# EAGLE design norns-shield (EAGLE 7.6.0)

## Sheet 1 of 2
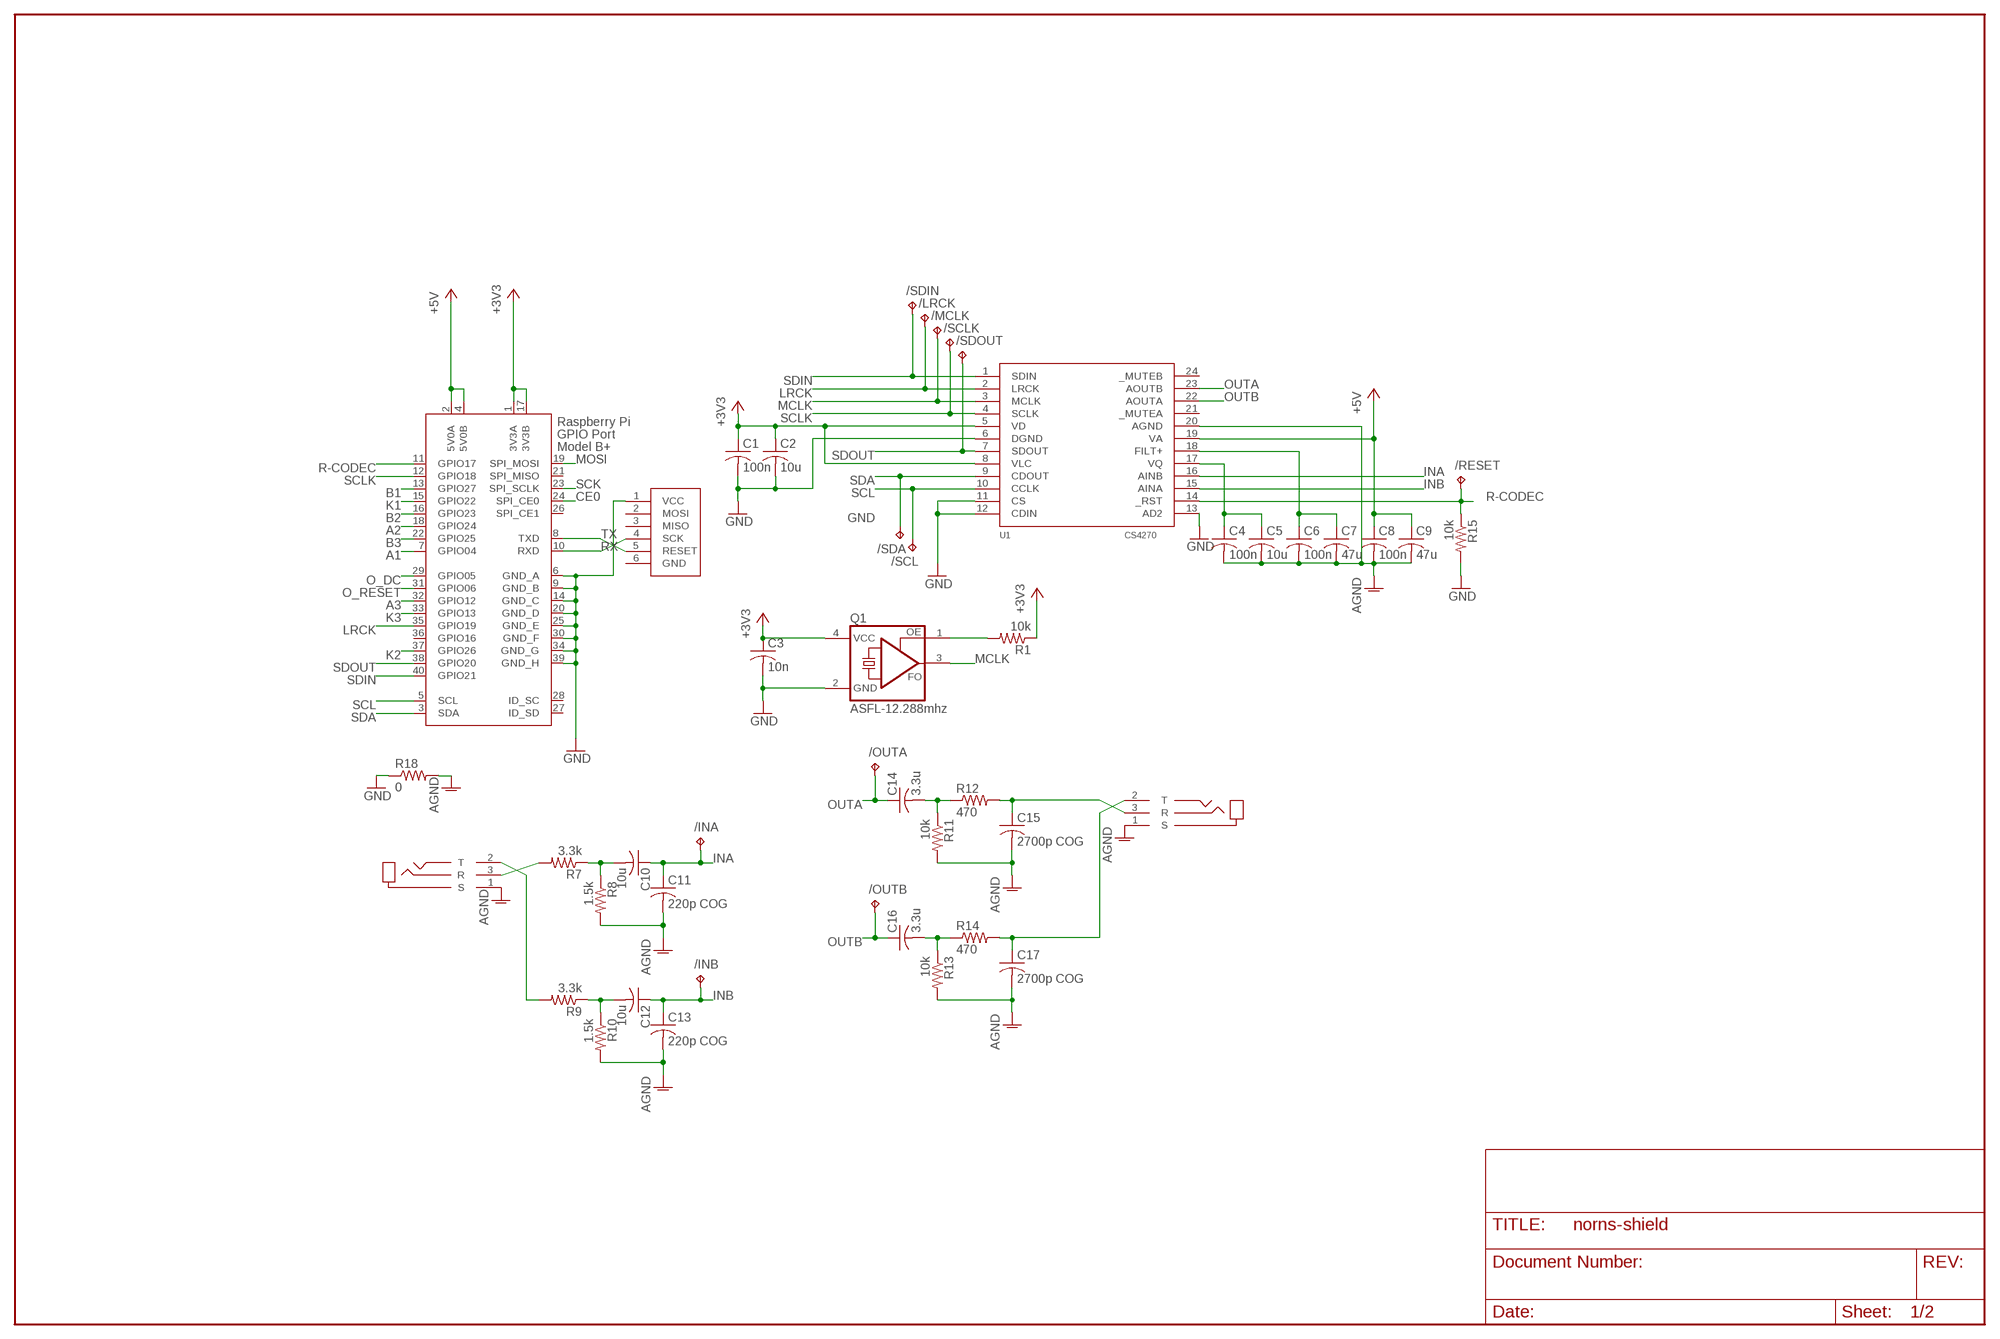
[diagram p0: schematic, sheet 1]

### Parts
/INA  TPTP12R  [TP12R]
/INB  TPTP12R  [TP12R]
/LRCK  TPTP12R  [TP12R]
/MCLK  TPTP12R  [TP12R]
/OUTA  TPTP12R  [TP12R]
/OUTB  TPTP12R  [TP12R]
/RESET  TPTP12R  [TP12R]
/SCL  TPTP12R  [TP12R]
/SCLK  TPTP12R  [TP12R]
/SDA  TPTP12R  [TP12R]
/SDIN  TPTP12R  [TP12R]
/SDOUT  TPTP12R  [TP12R]
C1  100n  C-USC0603  [C0603]
C2  10u  C-USC0805  [C0805]
C3  10n  C-USC0603  [C0603]
C4  100n  C-USC0603  [C0603]
C5  10u  C-USC0805  [C0805]
C6  100n  C-USC0603  [C0603]
C7  47u  C-USC1206  [C1206]
C8  100n  C-USC0603  [C0603]
C9  47u  C-USC1206  [C1206]
C10  10u  C-USC0805  [C0805]
C11  220p COG  C-USC0603  [C0603]
C12  10u  C-USC0805  [C0805]
C13  220p COG  C-USC0603  [C0603]
C14  3.3u  C-USC0805  [C0805]
C15  2700p COG  C-USC0603  [C0603]
C16  3.3u  C-USC0805  [C0805]
C17  2700p COG  C-USC0603  [C0603]
J1  TRS-IN  JACK-TRS  [SJ-3523-SMT]
J2  TRS-OUT  JACK-TRS  [SJ-3523-SMT]
J3  ISP-ROW  [ISP-ROW]
Q1  ASFL-12.288mhz  ASFL  [ASF]
R1  10k  R-US_R0603  [R0603]
R7  3.3k  R-US_R0603  [R0603]
R8  1.5k  R-US_R0603  [R0603]
R9  3.3k  R-US_R0603  [R0603]
R10  1.5k  R-US_R0603  [R0603]
R11  10k  R-US_R0603  [R0603]
R12  470  R-US_R0603  [R0603]
R13  10k  R-US_R0603  [R0603]
R14  470  R-US_R0603  [R0603]
R15  10k  R-US_R0603  [R0603]
R18  0  R-US_R0603  [R0603]
U1  CS4270  [TSSOP24]
X1  RASPI_BOARD_B+#_E3  [RASPI_BOARD_B+_EDGES_3DRILL]

### Nets
+3V3: C1.1 C2.1 C3.1 Q1.4(VCC) R1.1 U1.5(VD) U1.8(VLC) X1.1(3V3A) X1.17(3V3B) ; also sheet 2
+5V: C8.1 C9.1 U1.19(VA) X1.2(5V0A) X1.4(5V0B)
A1: X1.7(GPIO04) ; also sheet 2
A2: X1.18(GPIO24) ; also sheet 2
A3: X1.32(GPIO12) ; also sheet 2
AGND: C4.2 C5.2 C6.2 C7.2 C8.2 C9.2 C11.2 C13.2 C15.2 C17.2 J1.1(S) J2.1(S) R8.2 R10.2 R11.2 R13.2 R18.2 U1.20(AGND)
B1: X1.13(GPIO27) ; also sheet 2
B2: X1.16(GPIO23) ; also sheet 2
B3: X1.22(GPIO25) ; also sheet 2
CE0: X1.24(SPI_CE0) ; also sheet 2
GND: C1.2 C2.2 C3.2 J3.1(VCC) Q1.2(GND) R15.2 R18.1 U1.6(DGND) U1.11(CS) U1.12(CDIN) U1.13(AD2) X1.6(GND_A) X1.9(GND_B) X1.14(GND_C) X1.20(GND_D) X1.25(GND_E) X1.30(GND_F) X1.34(GND_G) X1.39(GND_H) ; also sheet 2
INA: /INA.TP C10.1 C11.1 U1.16(AINB)
INB: /INB.TP C12.1 C13.1 U1.15(AINA)
K1: X1.15(GPIO22) ; also sheet 2
K2: X1.37(GPIO26) ; also sheet 2
K3: X1.33(GPIO13) ; also sheet 2
LRCK: /LRCK.TP U1.2(LRCK) X1.35(GPIO19)
MCLK: /MCLK.TP Q1.3(FO) U1.3(MCLK)
MOSI: X1.19(SPI_MOSI) ; also sheet 2
N$1: Q1.1(OE) R1.2
N$4: C4.1 C5.1 U1.17(VQ)
N$5: C6.1 C7.1 U1.18(FILT+)
N$7: J1.3(R) R7.2
N$9: C10.2 R7.1 R8.1
N$10: C12.2 R9.1 R10.1
N$12: J1.2(T) R9.2
N$13: C16.2 R13.1 R14.1
N$14: C14.2 R11.1 R12.1
N$15: C15.1 J2.3(R) R12.2
N$16: C17.1 J2.2(T) R14.2
O_DC: X1.29(GPIO05) ; also sheet 2
O_RESET: X1.31(GPIO06) ; also sheet 2
OUTA: /OUTA.TP C14.1 U1.23(AOUTB)
OUTB: /OUTB.TP C16.1 U1.22(AOUTA)
R-CODEC: /RESET.TP R15.1 U1.14(_RST) X1.11(GPIO17)
RX: J3.4(SCK) X1.10(RXD)
SCK: X1.23(SPI_SCLK) ; also sheet 2
SCL: /SCL.TP U1.10(CCLK) X1.5(SCL)
SCLK: /SCLK.TP U1.4(SCLK) X1.12(GPIO18)
SDA: /SDA.TP U1.9(CDOUT) X1.3(SDA)
SDIN: /SDIN.TP U1.1(SDIN) X1.40(GPIO21)
SDOUT: /SDOUT.TP U1.7(SDOUT) X1.38(GPIO20)
TX: J3.5(RESET) X1.8(TXD)
Unconnected: J3.2(MOSI) J3.3(MISO) J3.6(GND) U1.21(_MUTEA) U1.24(_MUTEB) X1.21(SPI_MISO) X1.26(SPI_CE1) X1.27(ID_SD) X1.28(ID_SC) X1.36(GPIO16)

## Sheet 2 of 2
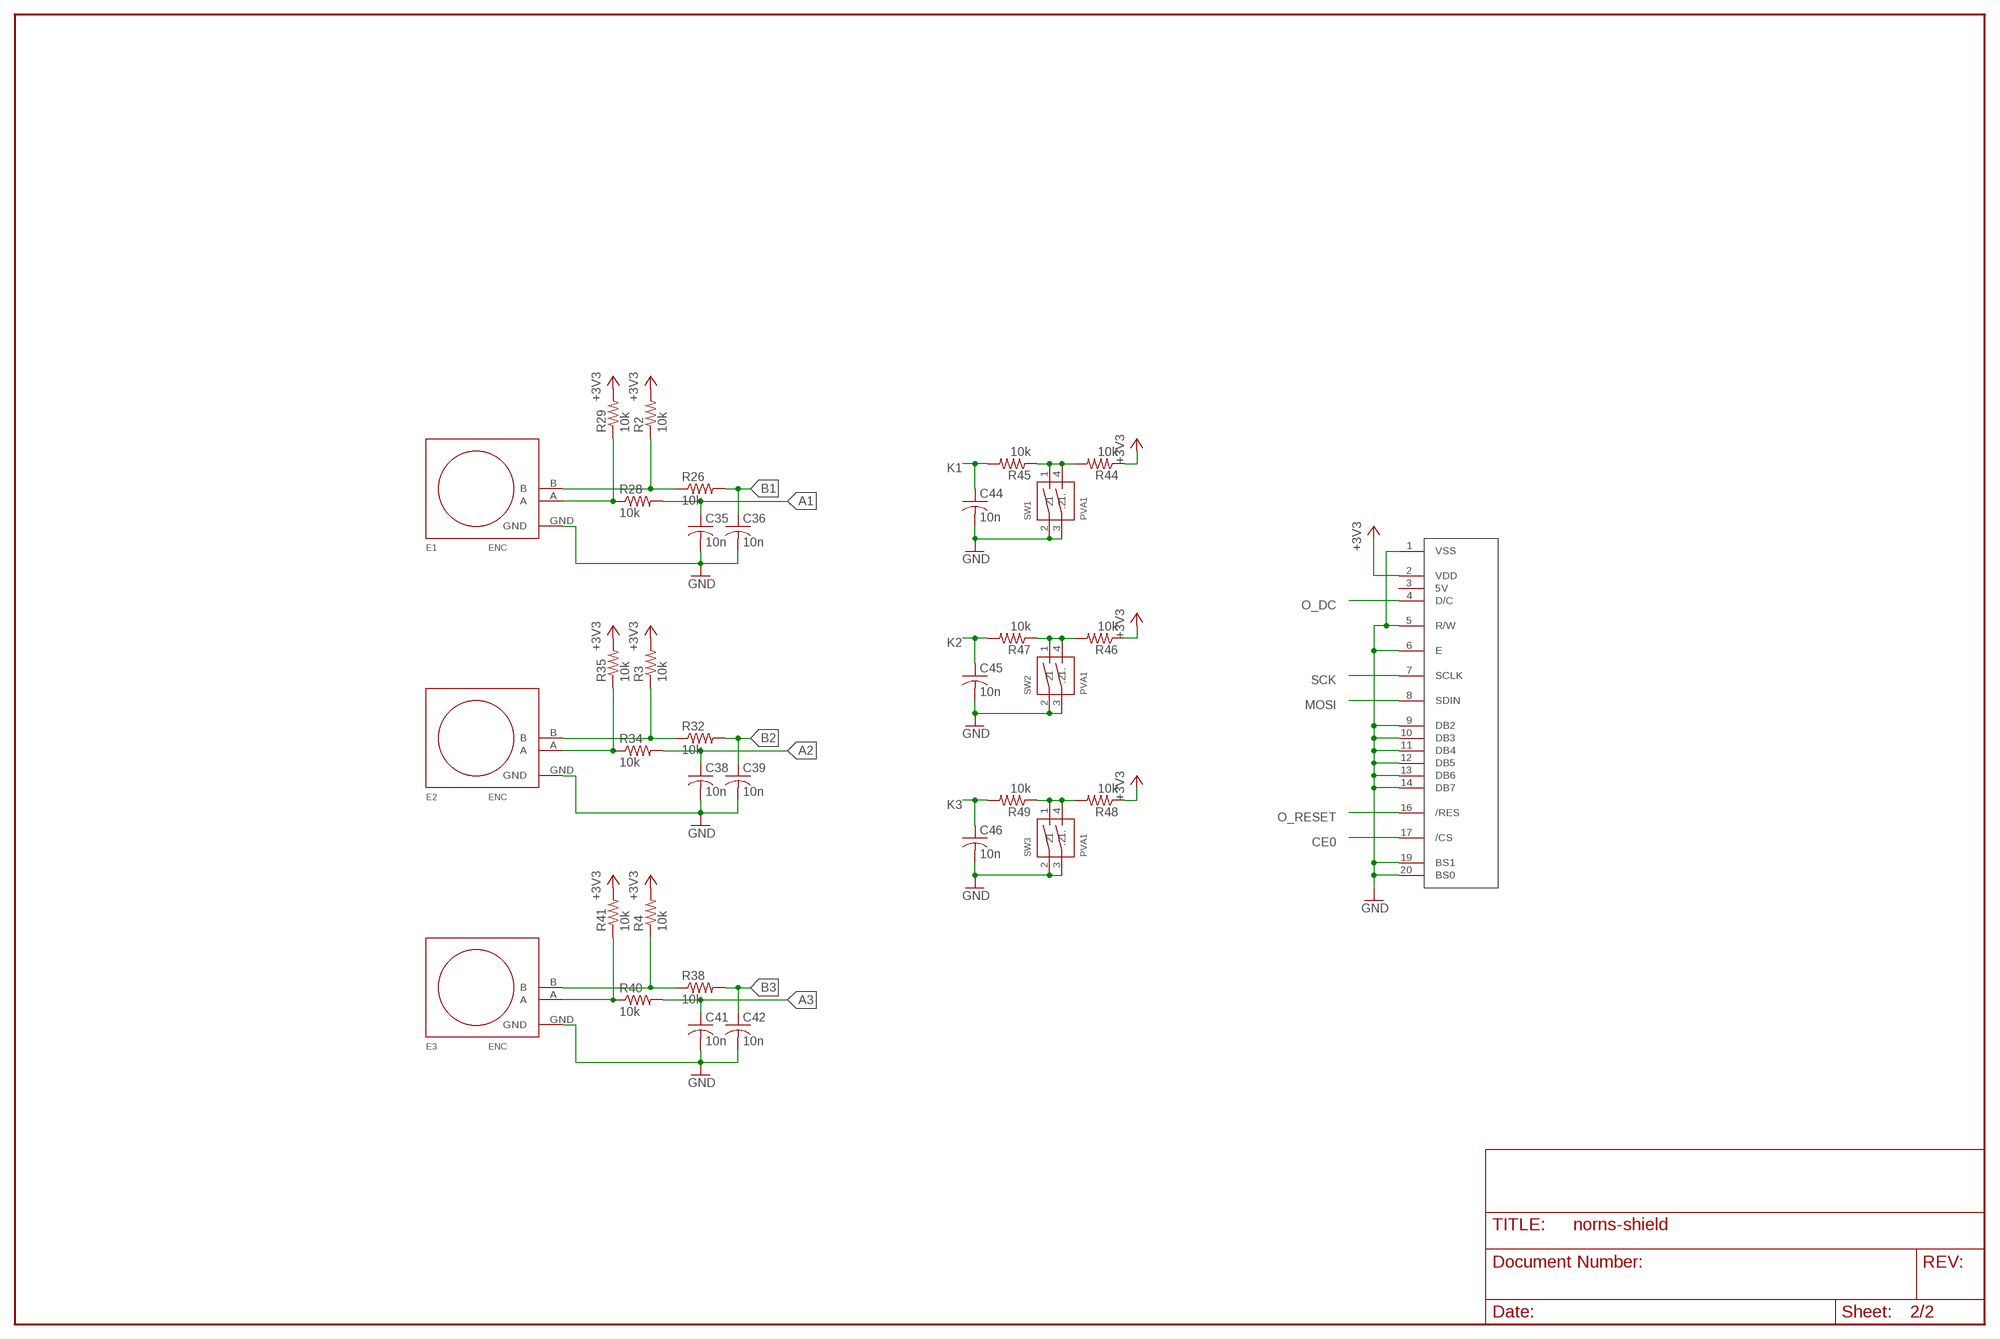
[diagram p1: schematic, sheet 2]

### Parts
C35  10n  C-USC0603  [C0603]
C36  10n  C-USC0603  [C0603]
C38  10n  C-USC0603  [C0603]
C39  10n  C-USC0603  [C0603]
C41  10n  C-USC0603  [C0603]
C42  10n  C-USC0603  [C0603]
C44  10n  C-USC0603  [C0603]
C45  10n  C-USC0603  [C0603]
C46  10n  C-USC0603  [C0603]
E1  ENC  [PEC11RN]
E2  ENC  [PEC11RN]
E3  ENC  [PEC11RN]
R2  10k  R-US_R0603  [R0603]
R3  10k  R-US_R0603  [R0603]
R4  10k  R-US_R0603  [R0603]
R26  10k  R-US_R0603  [R0603]
R28  10k  R-US_R0603  [R0603]
R29  10k  R-US_R0603  [R0603]
R32  10k  R-US_R0603  [R0603]
R34  10k  R-US_R0603  [R0603]
R35  10k  R-US_R0603  [R0603]
R38  10k  R-US_R0603  [R0603]
R40  10k  R-US_R0603  [R0603]
R41  10k  R-US_R0603  [R0603]
R44  10k  R-US_R0603  [R0603]
R45  10k  R-US_R0603  [R0603]
R46  10k  R-US_R0603  [R0603]
R47  10k  R-US_R0603  [R0603]
R48  10k  R-US_R0603  [R0603]
R49  10k  R-US_R0603  [R0603]
SW1  PVA1  [PVA1]
SW2  PVA1  [PVA1]
SW3  PVA1  [PVA1]
U$1  OLED128X64  [OLED-ALEPH]

### Nets
+3V3: R2.2 R3.2 R4.2 R29.2 R35.2 R41.2 R44.1 R46.1 R48.1 U$1.2(VDD) ; also sheet 1
A1: C35.1 R28.2 ; also sheet 1
A2: C38.1 R34.2 ; also sheet 1
A3: C41.1 R40.2 ; also sheet 1
B1: C36.1 R26.2 ; also sheet 1
B2: C39.1 R32.2 ; also sheet 1
B3: C42.1 R38.2 ; also sheet 1
CE0: U$1.17(/CS) ; also sheet 1
GND: C35.2 C36.2 C38.2 C39.2 C41.2 C42.2 C44.2 C45.2 C46.2 E1.GND E2.GND E3.GND SW1.2 SW1.3(1.) SW2.2 SW2.3(1.) SW3.2 SW3.3(1.) U$1.1(VSS) U$1.5(R/W) U$1.6(E) U$1.9(DB2) U$1.10(DB3) U$1.11(DB4) U$1.12(DB5) U$1.13(DB6) U$1.14(DB7) U$1.19(BS1) U$1.20(BS0) ; also sheet 1
K1: C44.1 R45.2 ; also sheet 1
K2: C45.1 R47.2 ; also sheet 1
K3: C46.1 R49.2 ; also sheet 1
MOSI: U$1.8(SDIN) ; also sheet 1
N$2: R44.2 R45.1 SW1.1 SW1.4(.2)
N$3: R46.2 R47.1 SW2.1 SW2.4(.2)
N$6: R48.2 R49.1 SW3.1 SW3.4(.2)
N$18: E1.A R28.1 R29.1
N$19: E1.B R2.1 R26.1
N$22: E2.B R3.1 R32.1
N$25: E2.A R34.1 R35.1
N$27: E3.B R4.1 R38.1
N$28: E3.A R40.1 R41.1
O_DC: U$1.4(D/C) ; also sheet 1
O_RESET: U$1.16(/RES) ; also sheet 1
SCK: U$1.7(SCLK) ; also sheet 1
Unconnected: U$1.3(5V)

## Library data of the parts
/INA /INB /LRCK /MCLK /OUTA /OUTB /RESET /SCL /SCLK /SDA /SDIN /SDOUT = testpad:TP: Test pad
C1-C17 C35 C36 C38 C39 C41 C42 C44-C46 = rcl:C-US: CAPACITOR, American symbol
E1-E3 = lines:ENC
J1 J2 = lines:JACK-TRS
J3 = monome-inc:ISP-ROW
Q1 = crystal:ASF*: CRYSTAL CLOCK OSCILLATORS 5.0 Vdc or 3.3 Vdc - LOW PROFILE ULTRA MINIATURE CERAMIC SURFACE MOUNT Source: http://www.abracon.com/Oscillators/asf1-L-L1.pdf; MPN: ASFLM1-50.000MHZ-C-T; OC_FARNELL: 1838931; OC_NEWARK: 99M0411
R1-R4 R7-R15 R18 R26 R28 R29 R32 R34 R35 R38 R40 R41 R44-R49 = rcl:R-US_: RESISTOR, American symbol
SW1-SW3 = monome-inc:PVA1
U1 = lines:CS4270
U$1 = monome_modular:OLED128X64
X1 = raspberrypi_bastelstube_v13:RASPI_BOARD_B+#: Raspberry Pi GPIO connector with markings for the outer dimensions of the Raspberry Pi board model B+ with different sets of drill holes or mounting pads All pins connected

## Board
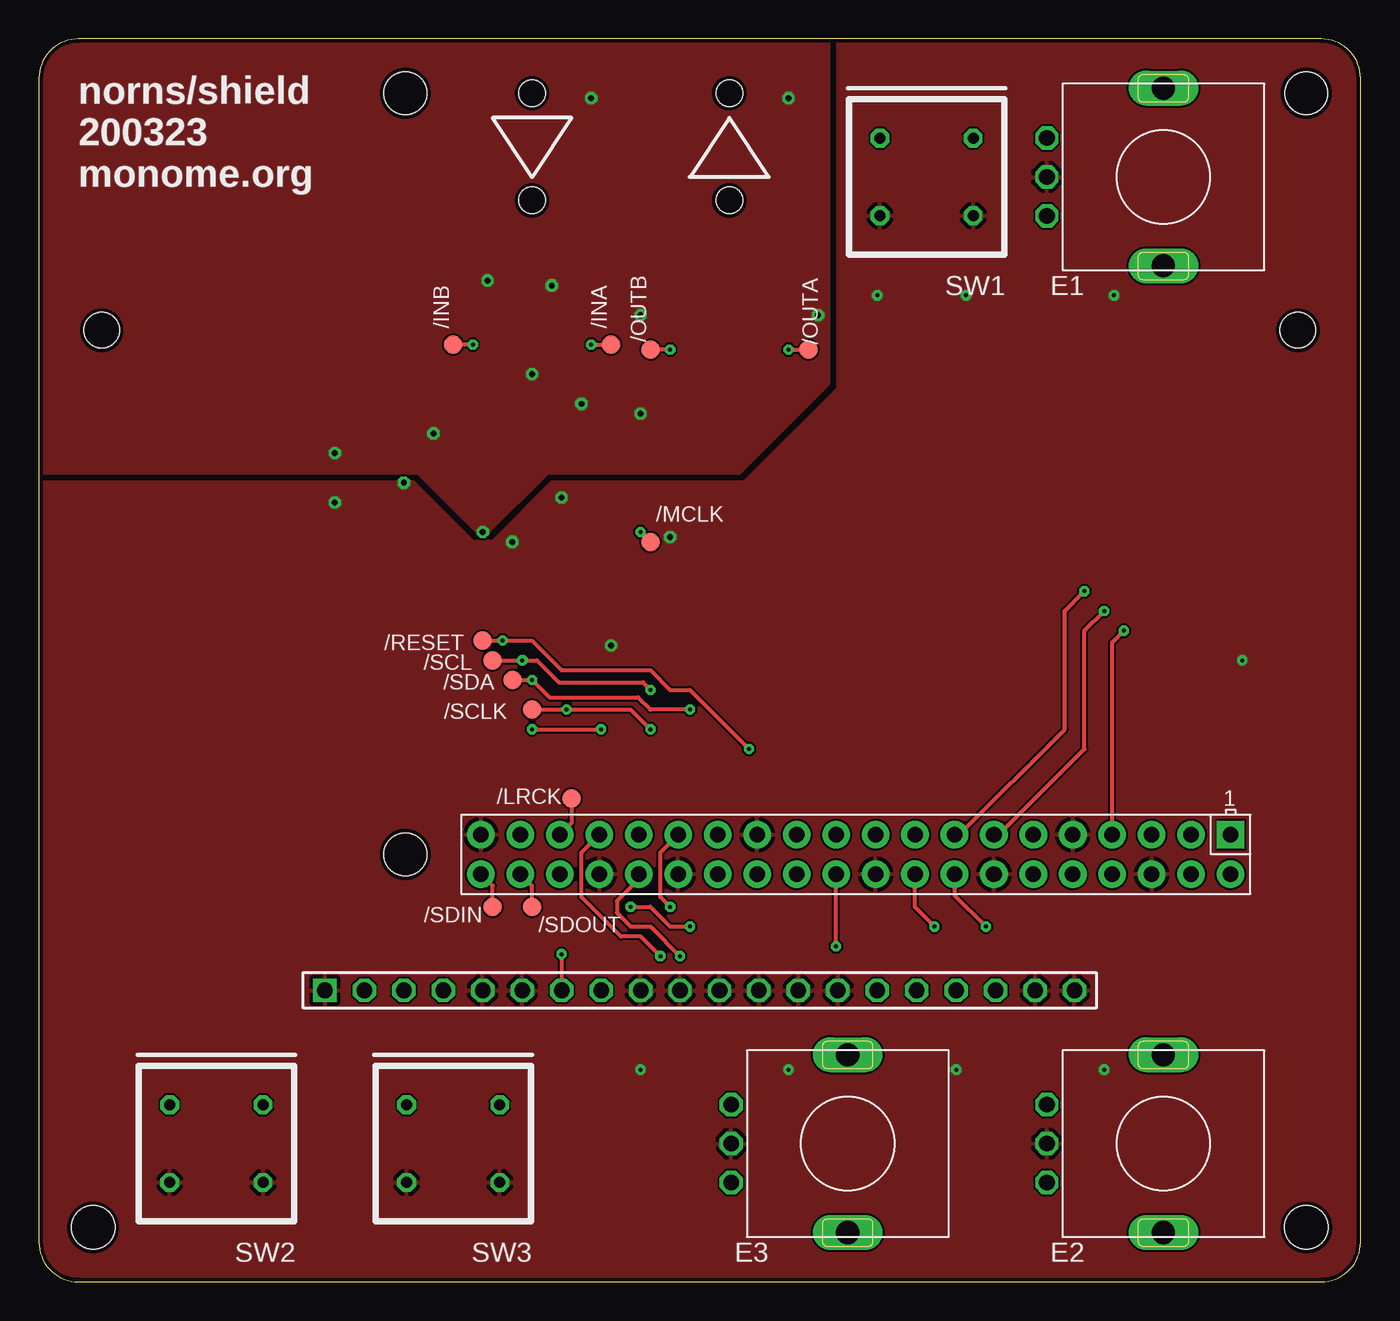
[diagram p2: board, top side]
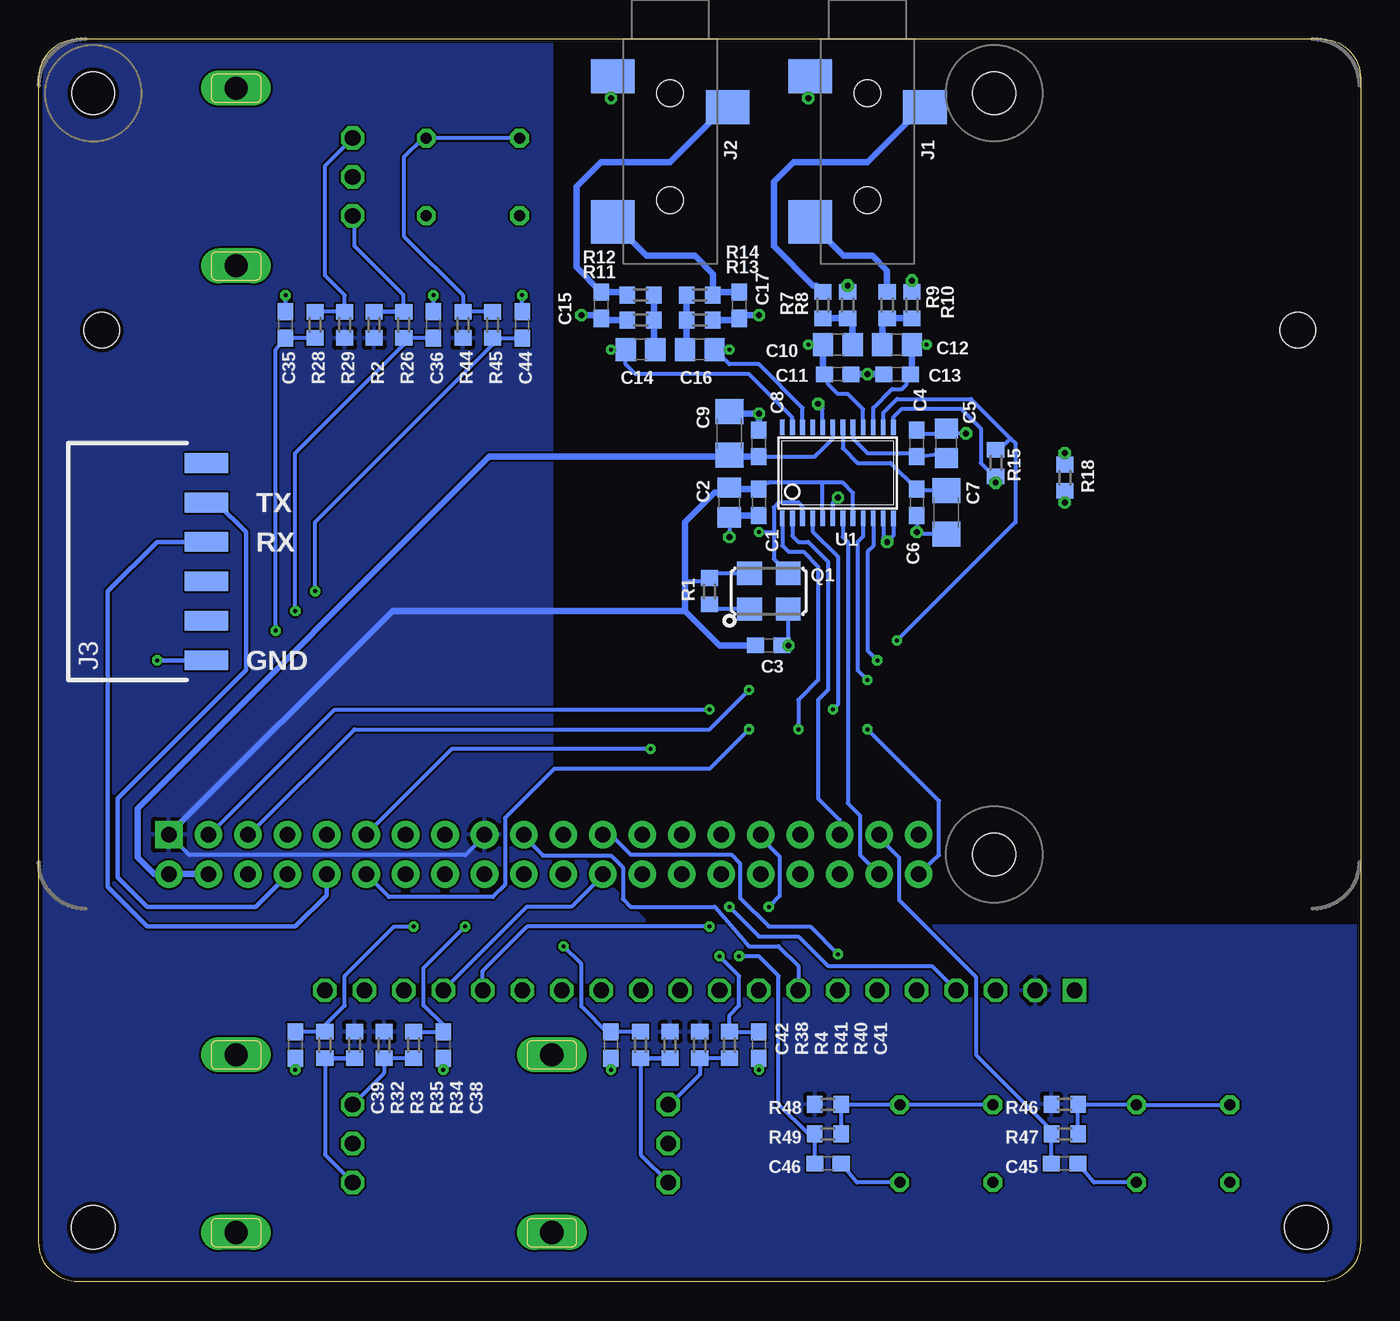
[diagram p3: board, bottom side, seen from below]

Size 85.09 x 80.01 mm. Coordinates in mm from the lower left corner, seen from the top.
Outline: 0,77.47 0,2.54 arc90 2.54,0 82.55,0 arc90 85.09,2.54 85.09,77.47 arc90 82.55,80.01 2.54,80.01 arc90 0,77.47
Copper layers (1*16): Top 0.035mm / dielectric 1.5mm / Bottom 0.035mm
Design rules "default *": minimum track width 8mil, minimum drill 10mil, track to track 5mil, track to pad 5mil, pad to pad 5mil, via to via 5mil, smd to smd 0mil, copper to edge 10mil, drill to drill 8mil, minimum pad ring 10mil, minimum via ring 8mil, stop-mask expansion 4mil, vias tented up to drill 0mil, thermal gap 10mil
Holes 2.8 mm at 81.6,3.49 3.49,3.49

### Footprints (pad centres in the part's own frame; a part is rotated, then mirrored left to right if it is on the bottom)
TP12R = smd 1.2 x 1.2: TP 0,0
C0603 = smd 1.1 x 1: 1 -0.85,0; 2 0.85,0
C0805 = smd 1.3 x 1.5: 1 -0.95,0; 2 0.95,0
C1206 = smd 1.6 x 1.8: 1 -1.4,0; 2 1.4,0
PEC11RN = drill 1 octagon: A -2.5,-7.5; B 2.5,-7.5; GND 0,-7.5 | drill 1.5 long: P$1 -5.715,0; P$2 5.715,0
SJ-3523-SMT = smd 2.2 x 2.8: 1 2.4,-3.7; 3 4.4,3.7 | smd 2.8 x 2.8: 2 11.8,-3.7 | hole 1.7: 3.5,0; 3.5,0; 10.4,0
ISP-ROW = smd 1.27 x 2.794: 1 -6.35,0; 2 -3.81,0; 3 -1.27,0; 4 1.27,0; 5 3.81,0; 6 6.35,0
ASF = smd 1.6 x 1.5: 1 -1.25,-1.15; 2 1.25,-1.15; 3 1.25,1.15; 4 -1.25,1.15
R0603 = smd 1 x 1.1: 1 -0.85,0; 2 0.85,0
PVA1 = drill 0.7 octagon: 1 -3,-2.5; 2 -3,2.5; 3 3,2.5; 4 3,-2.5
TSSOP24 = smd 0.305 x 0.991: 1 -3.575,-2.918; 2 -2.925,-2.918; 3 -2.275,-2.918; 4 -1.625,-2.918; 5 -0.975,-2.918; 6 -0.325,-2.918; 7 0.325,-2.918; 8 0.975,-2.918; 9 1.625,-2.918; 10 2.275,-2.918; 11 2.925,-2.918; 12 3.575,-2.918; 13 3.575,2.918; 14 2.925,2.918; 15 2.275,2.918; 16 1.625,2.918; 17 0.975,2.918; 18 0.325,2.918; 19 -0.325,2.918; 20 -0.975,2.918; 21 -1.625,2.918; 22 -2.275,2.918; 23 -2.925,2.918; 24 -3.575,2.918
OLED-ALEPH = drill 1 pad 1.5 square: 1 24.13,21.25 | drill 1 pad 1.5 octagon: 2 21.59,21.25; 3 19.05,21.25; 4 16.51,21.25; 5 13.97,21.25; 6 11.43,21.25; 7 8.89,21.25; 8 6.35,21.25; 9 3.81,21.25; 10 1.27,21.25; 11 -1.27,21.25; 12 -3.81,21.25; 13 -6.35,21.25; 14 -8.89,21.25; 15 -11.43,21.25; 16 -13.97,21.25; 17 -16.51,21.25; 18 -19.05,21.25; 19 -21.59,21.25; 20 -24.13,21.25 | hole 2.286: 38.5,-21.25; -38.5,-21.25
RASPI_BOARD_B+_EDGES_3DRILL = drill 1 pad 1.778 square: 1 8.37,51.23 | drill 1 pad 1.778: 2 8.37,53.77; 3 10.91,51.23; 4 10.91,53.77; 5 13.45,51.23; 6 13.45,53.77; 7 15.99,51.23; 8 15.99,53.77; 9 18.53,51.23; 10 18.53,53.77; 11 21.07,51.23; 12 21.07,53.77; 13 23.61,51.23; 14 23.61,53.77; 15 26.15,51.23; 16 26.15,53.77; 17 28.69,51.23; 18 28.69,53.77; 19 31.23,51.23; 20 31.23,53.77; 21 33.77,51.23; 22 33.77,53.77; 23 36.31,51.23; 24 36.31,53.77; 25 38.85,51.23; 26 38.85,53.77; 27 41.39,51.23; 28 41.39,53.77; 29 43.93,51.23; 30 43.93,53.77; 31 46.47,51.23; 32 46.47,53.77; 33 49.01,51.23; 34 49.01,53.77; 35 51.55,51.23; 36 51.55,53.77; 37 54.09,51.23; 38 54.09,53.77; 39 56.63,51.23; 40 56.63,53.77 | hole 2.75: 3.5,3.5; 61.5,3.5; 61.5,52.5

### Placement (x,y rotation side)
/INA  36.83,60.33 90 top
/INB  26.67,60.33 90 top
/LRCK  34.29,31.11 180 top
/MCLK  39.37,47.62 180 top
/OUTA  49.53,60.01 90 top
/OUTB  39.37,60.01 90 top
/RESET  28.57,41.27 0 top
/SCL  29.21,40 270 top
/SCLK  31.75,36.83 270 top
/SDA  30.48,38.73 270 top
/SDIN  29.21,24.13 180 top
/SDOUT  31.75,24.13 180 top
C1  38.73,50.16 270 bottom
C2  40.64,50.16 270 bottom
C3  38.1,40.96 0 bottom
C4  28.57,53.97 90 bottom
C5  26.67,53.97 90 bottom
C6  28.57,50.16 270 bottom
C7  26.67,49.53 270 bottom
C8  38.73,53.97 90 bottom
C9  40.64,54.61 90 bottom
C10  33.66,60.33 0 bottom
C11  33.66,58.42 0 bottom
C12  29.84,60.33 180 bottom
C13  29.84,58.42 180 bottom
C14  46.35,60.01 0 bottom
C15  48.9,62.86 270 bottom
C16  42.55,60.01 180 bottom
C17  40.01,62.86 270 bottom
C35  69.22,61.59 90 bottom
C36  59.69,61.59 90 bottom
C38  59.05,15.24 270 bottom
C39  68.58,15.24 270 bottom
C41  38.73,15.24 270 bottom
C42  48.26,15.24 270 bottom
C44  53.98,61.59 90 bottom
C45  19.05,7.62 0 bottom
C46  34.29,7.62 0 bottom
E1  72.39,71.12 270 top
E2  72.39,8.89 270 top
E3  52.07,8.89 270 top
J1  31.75,80.01 270 bottom
J2  44.45,80.01 270 bottom
J3  74.3,46.36 90 bottom
Q1  38.1,44.45 0 bottom
R1  41.91,44.45 270 bottom
R2  63.5,61.59 270 bottom
R3  64.77,15.24 90 bottom
R4  44.45,15.24 90 bottom
R7  34.61,62.86 90 bottom
R8  33.02,62.86 90 bottom
R9  30.48,62.86 90 bottom
R10  28.89,62.86 90 bottom
R11  46.35,61.91 180 bottom
R12  46.35,63.5 180 bottom
R13  42.55,61.91 0 bottom
R14  42.55,63.5 0 bottom
R15  23.5,52.7 270 bottom
R18  19.05,51.75 90 bottom
R26  61.59,61.59 270 bottom
R28  67.31,61.59 270 bottom
R29  65.41,61.59 270 bottom
R32  66.67,15.24 90 bottom
R34  60.96,15.24 90 bottom
R35  62.87,15.24 90 bottom
R38  46.35,15.24 90 bottom
R40  40.64,15.24 90 bottom
R41  42.55,15.24 90 bottom
R44  57.78,61.59 90 bottom
R45  55.88,61.59 270 bottom
R46  19.05,11.43 0 bottom
R47  19.05,9.52 180 bottom
R48  34.29,11.43 0 bottom
R49  34.29,9.52 180 bottom
SW1  57.15,71.12 180 top
SW2  11.43,8.89 180 top
SW3  26.67,8.89 180 top
U1  33.66,52.07 0 bottom
U$1  42.55,40 180 top
X1  85.09,80.01 180 top

### Tracks (layer width: path | path; a pad name or v marks a point on that pad's centre or on a via)
+3V3
  Bottom 0.254: 34.63,51.44 38.12,51.44 C1.1 | U1.5 34.63,51.44 | U1.8 32.68,50.78 33.34,51.44 34.63,51.44 | 40.54,51.02 C2.1 | 40.34,50.81 C2.1 | Q1.4 41.41,45.6 R1.1 41.91,45.08 43.5,45.08 | 40.95,50.8 C2.1 | X1.1 75.4,27.46 57.63,27.46 56.4,28.69 X1.17
  Bottom 0.406: C1.1 40.42,51.02 40.64,50.8 40.34,50.81 | C3.1 41.27,40.96 43.5,43.18 | 43.5,43.18 43.5,45.08 43.5,48.89 41.59,50.8 40.95,50.8 | 43.5,43.18 62.32,43.18 X1.1
  pour Bottom: 0,22.86 45.72,22.86 52.07,29.21 52.07,80.01 85.09,80.01 85.09,0 0,0
+5V
  Bottom 0.254: 40.64,53.12 C9.1 40.52,53.33 | C8.1 35.14,53.12 34.92,53.34 34.94,53.33 33.98,54.28 U1.19
  Bottom 0.406: C8.1 40.42,53.12 40.64,53.34 40.52,53.33 | 40.64,53.12 56.09,53.12 78.74,30.48 78.74,27.3 77.67,26.24 X1.2 X1.4
A1  (via drill 0.25)
  Top 0.254: X1.7 69.1,41.16 v69.85,41.91
  Bottom 0.254: R28.2 C35.1 69.85,59.99 v69.85,41.91
A2  (via drill 0.25)
  Top 0.254: v57.66,22.86 56.39,24.13 56.39,26.23 X1.18
  Bottom 0.254: R34.2 C38.1 59.04,16.52 60.33,17.78 60.33,20.19 v57.66,22.86
A3  (via drill 0.25)
  Top 0.254: X1.32 38.62,25.92 37.21,24.51 37.21,23.75 38.1,22.86 39.37,22.86 v41.27,20.95
  Bottom 0.254: C41.1 R40.2 40.64,17.14 40.01,17.78 40.01,19.68 v41.27,20.95
AGND  (via drill 0.38)
  Bottom 0.254: U1.20 34.63,56.22 v34.92,56.52 | C4.2 28.36,54.61 26.98,54.61 C5.2 26.36,54.61 v25.4,54.61 | C6.2 v28.57,48.26 28.45,48.13 C7.2 | 40.64,55.88 C9.2
  Bottom 0.406: C8.2 v38.73,55.88 40.64,55.88 | R8.2 v33.02,64.14 | R10.2 v28.89,64.45 | J1.1 35.45,77.58 35.56,77.47 v35.56,76.2 | J2.1 48.15,77.58 48.26,77.47 v48.26,76.2 | C11.2 v31.75,58.42 C13.2 | R18.2 v19.05,53.34 | R13.2 40.11,61.91 C17.2 39.79,62.23 v38.73,62.23 | R11.2 48.79,61.91 C15.2 49.11,62.23 v50.16,62.23
  pour Top: 50.8,80.01 50.8,57.78 45.09,52.07 32.7,52.07 28.89,48.26 28.26,48.26 24.45,52.07 0,52.07 0,80.01
B1  (via drill 0.25)
  Top 0.254: X1.13 61.8,28.78 67.31,34.29 67.31,41.91 v68.58,43.18
  Bottom 0.254: C36.1 R26.2 61.59,60.33 68.58,53.34 v68.58,43.18
B2  (via drill 0.25)
  Top 0.254: v60.96,22.86 58.94,24.88 X1.16
  Bottom 0.254: C39.1 R32.2 66.66,16.52 65.41,17.78 65.41,19.68 62.23,22.86 v60.96,22.86
B3  (via drill 0.25)
  Top 0.254: v51.31,21.59 51.31,26.23 X1.22
  Bottom 0.254: R38.2 C42.1 48.34,15.89 50.16,17.72 50.16,20.45 v51.31,21.59
CE0
  Bottom 0.254: X1.24 48.78,26.15 50.8,24.13 53.68,24.13 U$1.17
GND  (via drill 0.25, 0.38)
  Bottom 0.254: U1.6 33.98,50.16 v33.66,50.48 | U1.12 30.08,48.02 v30.48,47.62 30.73,47.88 U1.11 | U1.13 30.08,55.64 29.53,56.2 25.72,56.2 24.45,54.93 24.45,52.7 23.8,52.05 R15.2 v23.5,51.44 | C2.2 v40.64,47.94 | C3.2 v36.83,40.96 36.83,43.28 Q1.2 | C36.2 v59.69,63.5 | C35.2 v69.22,63.5 | C41.2 v38.73,13.65 | C42.2 v48.26,13.65 | C38.2 v59.05,13.65 | C39.2 v68.58,13.65 | C45.2 17.17,6.39 SW2.2 | C46.2 32.41,6.39 SW3.2 | C44.2 53.96,62.25 v53.98,63.5
  Bottom 0.305: J3.1 v77.47,40
  Bottom 0.406: R18.1 v19.05,50.16 | C1.2 40.54,49.31 C2.2
  pour Top: 85.09,0 85.09,80.01 51.44,80.01 51.44,57.47 45.4,51.44 33.02,51.44 29.21,47.62 27.94,47.62 24.13,51.44 0,51.44 0,0
INA  (via drill 0.25)
  Top 0.254: v35.56,60.33 /INA.TP
  Bottom 0.254: U1.16 32.03,56.16 33.02,57.15 33.66,57.15 34.29,57.78 34.29,58.41 C11.1 | C10.1 v35.56,60.33
  Bottom 0.406: C10.1 34.6,58.52 C11.1
INB  (via drill 0.25)
  Top 0.254: v27.94,60.33 /INB.TP
  Bottom 0.254: U1.15 31.38,56.25 30.16,57.47 29.53,57.47 29.21,57.78 29.21,58.41 C13.1 | C12.1 v27.94,60.33
  Bottom 0.406: C12.1 28.89,58.52 C13.1
K1  (via drill 0.25)
  Top 0.254: X1.15 59.26,28.78 66.04,35.56 66.04,43.18 v67.31,44.45
  Bottom 0.254: C44.1 R45.2 55.88,60.33 67.31,48.89 v67.31,44.45
K2
  Bottom 0.254: C45.1 R47.2 20,9.84 24.77,14.6 24.77,19.62 29.72,24.57 29.72,27.3 31,28.59 X1.37
K3  (via drill 0.25)
  Top 0.254: v40.01,20.95 38.73,22.22 37.47,22.22 34.92,24.77 34.92,27.62 X1.33
  Bottom 0.254: C46.1 R49.2 35.56,9.52 37.47,11.43 37.47,19.68 38.73,20.95 v40.01,20.95
LRCK
  Top 0.254: /LRCK.TP 34.29,29.53 X1.35
  Bottom 0.254: U1.2 36.58,48.01 36.2,47.62 35.56,47.62 34.29,46.36 34.29,38.1 34.92,37.47 34.92,31.11 33.54,29.73 X1.35
MCLK  (via drill 0.25)
  Top 0.254: /MCLK.TP v38.73,48.26
  Bottom 0.254: U1.3 35.93,49.9 36.2,50.16 37.47,50.16 37.78,49.85 37.78,48.26 | 37.78,48.26 37.78,46.53 Q1.3 | v38.73,48.26 37.78,48.26
MOSI
  Bottom 0.254: X1.19 53.86,28.65 52.64,27.43 48.26,27.43 47.5,26.67 47.5,24.64 46.99,24.13 41.57,24.13 39.37,21.59 37.47,21.59 36.2,20.32 U$1.8
N$1
  Bottom 0.254: Q1.1 41.41,43.3 R1.2
N$2
  Bottom 0.254: SW1.4 SW1.1 60.37,73.62 61.59,72.39 61.59,67.31 57.78,63.5 R44.2 R45.1
N$3
  Bottom 0.254: R47.1 R46.2 14.47,11.43 SW2.1 SW2.4
N$4
  Bottom 0.254: U1.17 32.68,54.27 31.75,53.34 28.79,53.34 C4.1 26.97,53.33 C5.1
N$5
  Bottom 0.254: U1.18 33.33,53.65 32.38,52.7 30.27,52.7 C6.1 28.49,50.93 C7.1
N$6
  Bottom 0.254: R49.1 R48.2 33.6,11.39 SW3.1 SW3.4
N$7
  Bottom 0.406: J1.3 28.21,75.61 31.75,72.07 36.51,72.07 37.78,70.8 37.78,66.67 35.24,64.14 35.03,64.14 R7.2
N$9
  Bottom 0.406: R7.1 R8.1 32.7,61.7 C10.2
N$10
  Bottom 0.406: R10.1 R9.1 30.8,61.7 C12.2
N$12
  Bottom 0.406: R9.2 30.48,65.09 31.43,66.04 33.28,66.04 J1.2
N$13
  Bottom 0.406: R14.1 R13.1 43.4,60.11 C16.2 43.83,60.34
N$14
  Bottom 0.406: R12.1 R11.1 45.51,60.11 C14.2 45.07,60.34
N$15
  Bottom 0.406: R12.2 47.42,63.72 C15.1 50.48,65.3 50.48,70.48 48.9,72.07 44.45,72.07 40.91,75.61 J2.3
N$16
  Bottom 0.406: C17.1 41.48,63.72 R14.2 41.7,64.87 42.86,66.04 45.98,66.04 J2.2
N$18
  Bottom 0.254: R28.1 R29.1 65.41,63.5 66.67,64.77 66.67,71.83 E1.A
N$19
  Bottom 0.254: R26.1 61.61,63.52 64.77,66.67 64.77,68.5 E1.B
  Bottom 0.305: R26.1 R2.1
N$22
  Bottom 0.254: R32.1 66.67,8.17 E2.B
  Bottom 0.305: R3.1 R32.1
N$25
  Bottom 0.254: R34.1 R35.1 62.87,13.41 E2.A
N$27
  Bottom 0.254: R38.1 46.35,8.17 E3.B
  Bottom 0.305: R4.1 R38.1
N$28
  Bottom 0.254: R40.1 R41.1 42.55,13.33 44.45,11.43 44.45,11.51 E3.A
O_DC  (via drill 0.25)
  Top 0.254: v40.64,24.13 40.01,24.77 40.01,27.62 X1.29
  Bottom 0.254: v40.64,24.13 38.73,22.22 36.2,22.22 34.29,20.32 27.6,20.32 U$1.4
O_RESET  (via drill 0.25)
  Top 0.254: v38.1,24.13 39.37,24.13 40.64,22.86 v41.91,22.86
  Bottom 0.254: X1.31 38.62,28.59 37.4,27.37 37.4,24.83 v38.1,24.13 | v41.91,22.86 53.66,22.86 56.52,20 U$1.16
OUTA  (via drill 0.25)
  Top 0.254: v48.26,60.01 /OUTA.TP
  Bottom 0.254: U1.23 36.58,55.63 39.37,58.42 46.67,58.42 47.31,59.05 C14.1 v48.26,60.01
OUTB  (via drill 0.25)
  Top 0.254: v40.64,60.01 /OUTB.TP
  Bottom 0.254: U1.22 35.93,56.25 38.73,59.05 40.64,59.05 C16.1 v40.64,60.01
R-CODEC  (via drill 0.25)
  Top 0.254: v45.72,34.29 41.91,38.1 40.64,38.1 39.37,39.37 33.66,39.37 31.75,41.27 v29.84,41.27 /RESET.TP
  Bottom 0.254: U1.14 30.73,55.95 29.84,56.83 25.08,56.83 22.54,54.29 | 22.54,54.29 22.23,53.97 22.23,48.89 v29.84,41.27 | R15.1 23.48,53.36 22.54,54.29 | v45.72,34.29 58.51,34.29 X1.11
RX
  Bottom 0.305: X1.10 66.56,24.88 68.58,22.86 78.11,22.86 80.64,25.4 80.64,44.45 77.47,47.62 J3.4
SCK  (via drill 0.25)
  Top 0.254: v33.66,21.08 U$1.7
  Bottom 0.254: X1.23 48.27,28.78 46.99,27.49 40.51,27.49 39.94,26.92 39.94,24.7 38.1,22.86 35.43,22.86 v33.66,21.08
SCL  (via drill 0.25)
  Top 0.254: v39.37,38.1 38.89,38.58 33.5,38.58 32.07,40 v31.11,40 /SCL.TP
  Bottom 0.254: U1.10 31.38,47.36 31.75,46.99 31.75,40.64 v31.11,40 | X1.5 71.55,28.78 64.77,35.56 41.91,35.56 v39.37,38.1
SCLK  (via drill 0.25)
  Top 0.254: v39.37,35.56 38.1,36.83 v33.97,36.83 /SCLK.TP
  Bottom 0.254: U1.4 35.28,48.3 33.66,46.67 33.66,37.15 v33.97,36.83 | v39.37,35.56 41.91,33.02 51.91,33.02 55.09,29.84 55.09,25.56 55.88,24.77 62.55,24.77 X1.12
SDA  (via drill 0.25)
  Top 0.254: v41.91,36.83 39.37,36.83 38.58,37.62 32.86,37.62 v31.75,38.73 /SDA.TP
  Bottom 0.254: U1.9 32.03,47.98 32.38,47.62 32.38,39.37 v31.75,38.73 | X1.3 74.09,28.78 66.04,36.83 v41.91,36.83
SDIN  (via drill 0.25)
  Top 0.254: v31.75,35.56 v36.2,35.56 | /SDIN.TP 29.21,25.49 X1.40
  Bottom 0.254: U1.1 37.23,47.39 36.83,46.99 35.88,46.99 34.92,46.04 34.92,38.73 36.2,37.47 v36.2,35.56 | X1.40 27.15,27.46 27.15,30.96 v31.75,35.56
SDOUT
  Top 0.254: /SDOUT.TP 31.75,25.49 X1.38
  Bottom 0.254: U1.7 33.33,47.95 33.02,47.62 33.02,30.8 32.23,30 32.23,27.47 X1.38
TX
  Bottom 0.305: X1.8 69.1,26.15 71.12,24.13 78.11,24.13 80.01,26.04 80.01,31.11 71.75,39.37 71.75,48.26 73.66,50.16 J3.5

### Text on the board
tPlace: norns/shield / 200323 / monome.org
bNames: TX | RX | GND